# Altium schematic sheet TLD.SchDoc
size A; SheetNumber: 1; SheetTotal: 10
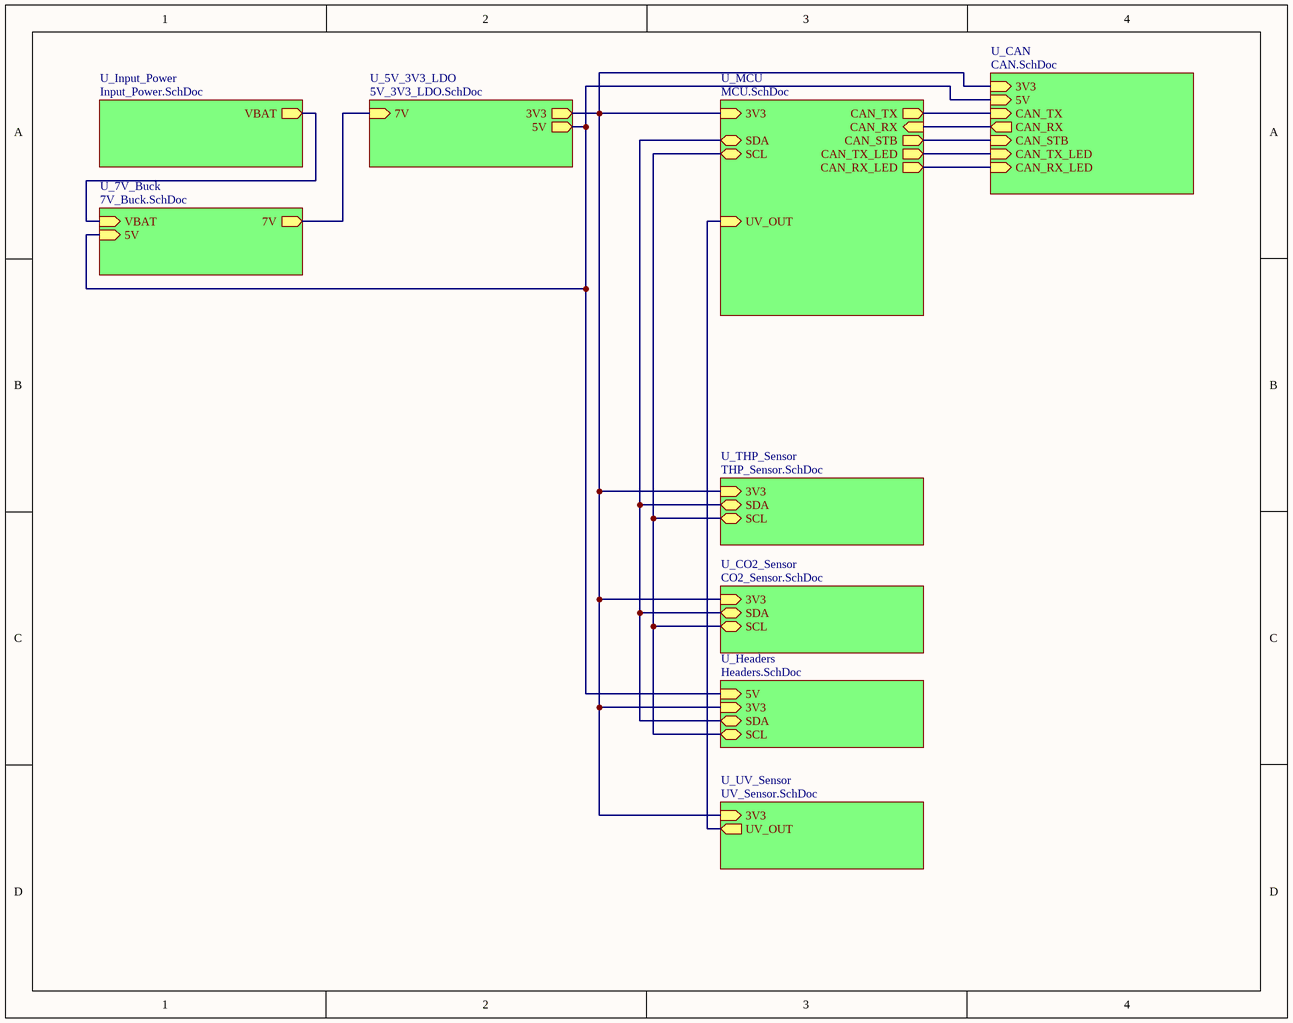
[diagram p0: TLD.SchDoc]

## Sub-sheets
U_5V_3V3_LDO = 5V_3V3_LDO.SchDoc: 3V3 (out), 5V (out), 7V (in)
U_7V_Buck = 7V_Buck.SchDoc: 7V (out), VBAT (in), 5V (in)
U_CAN = CAN.SchDoc: CAN_TX (in), CAN_RX (out), CAN_STB (in), CAN_TX_LED (in), CAN_RX_LED (in), 3V3 (in), 5V (in)
U_CO2_Sensor = CO2_Sensor.SchDoc: 3V3 (in), SDA (bidir), SCL (bidir)
U_Headers = Headers.SchDoc: SDA (bidir), SCL (bidir), 3V3 (in), 5V (in)
U_Input_Power = Input_Power.SchDoc: VBAT (out)
U_MCU = MCU.SchDoc: SDA (bidir), SCL (bidir), 3V3 (in), CAN_TX (out), CAN_RX (in), CAN_STB (out), CAN_TX_LED (out), CAN_RX_LED (out), UV_OUT (in)
U_THP_Sensor = THP_Sensor.SchDoc: SDA (bidir), SCL (bidir), 3V3 (in)
U_UV_Sensor = UV_Sensor.SchDoc: 3V3 (in), UV_OUT (out)

## Nets
(unnamed): sheet U_5V_3V3_LDO/3V3, sheet U_CAN/3V3, sheet U_CO2_Sensor/3V3, sheet U_MCU/3V3, sheet U_THP_Sensor/3V3, sheet U_UV_Sensor/3V3, sheet U_Headers/3V3
(unnamed): sheet U_5V_3V3_LDO/5V, sheet U_7V_Buck/5V, sheet U_CAN/5V, sheet U_Headers/5V
(unnamed): sheet U_5V_3V3_LDO/7V, sheet U_7V_Buck/7V
(unnamed): sheet U_7V_Buck/VBAT, sheet U_Input_Power/VBAT
(unnamed): sheet U_CAN/CAN_TX, sheet U_MCU/CAN_TX
(unnamed): sheet U_CAN/CAN_RX, sheet U_MCU/CAN_RX
(unnamed): sheet U_CAN/CAN_STB, sheet U_MCU/CAN_STB
(unnamed): sheet U_CAN/CAN_TX_LED, sheet U_MCU/CAN_TX_LED
(unnamed): sheet U_CAN/CAN_RX_LED, sheet U_MCU/CAN_RX_LED
(unnamed): sheet U_CO2_Sensor/SDA, sheet U_MCU/SDA, sheet U_THP_Sensor/SDA, sheet U_Headers/SDA
(unnamed): sheet U_CO2_Sensor/SCL, sheet U_MCU/SCL, sheet U_THP_Sensor/SCL, sheet U_Headers/SCL
(unnamed): sheet U_MCU/UV_OUT, sheet U_UV_Sensor/UV_OUT